# Altium schematic sheet 2_MCU.SchDoc
size 420 x 297 mm; SheetNumber: 2; SheetTotal: 7
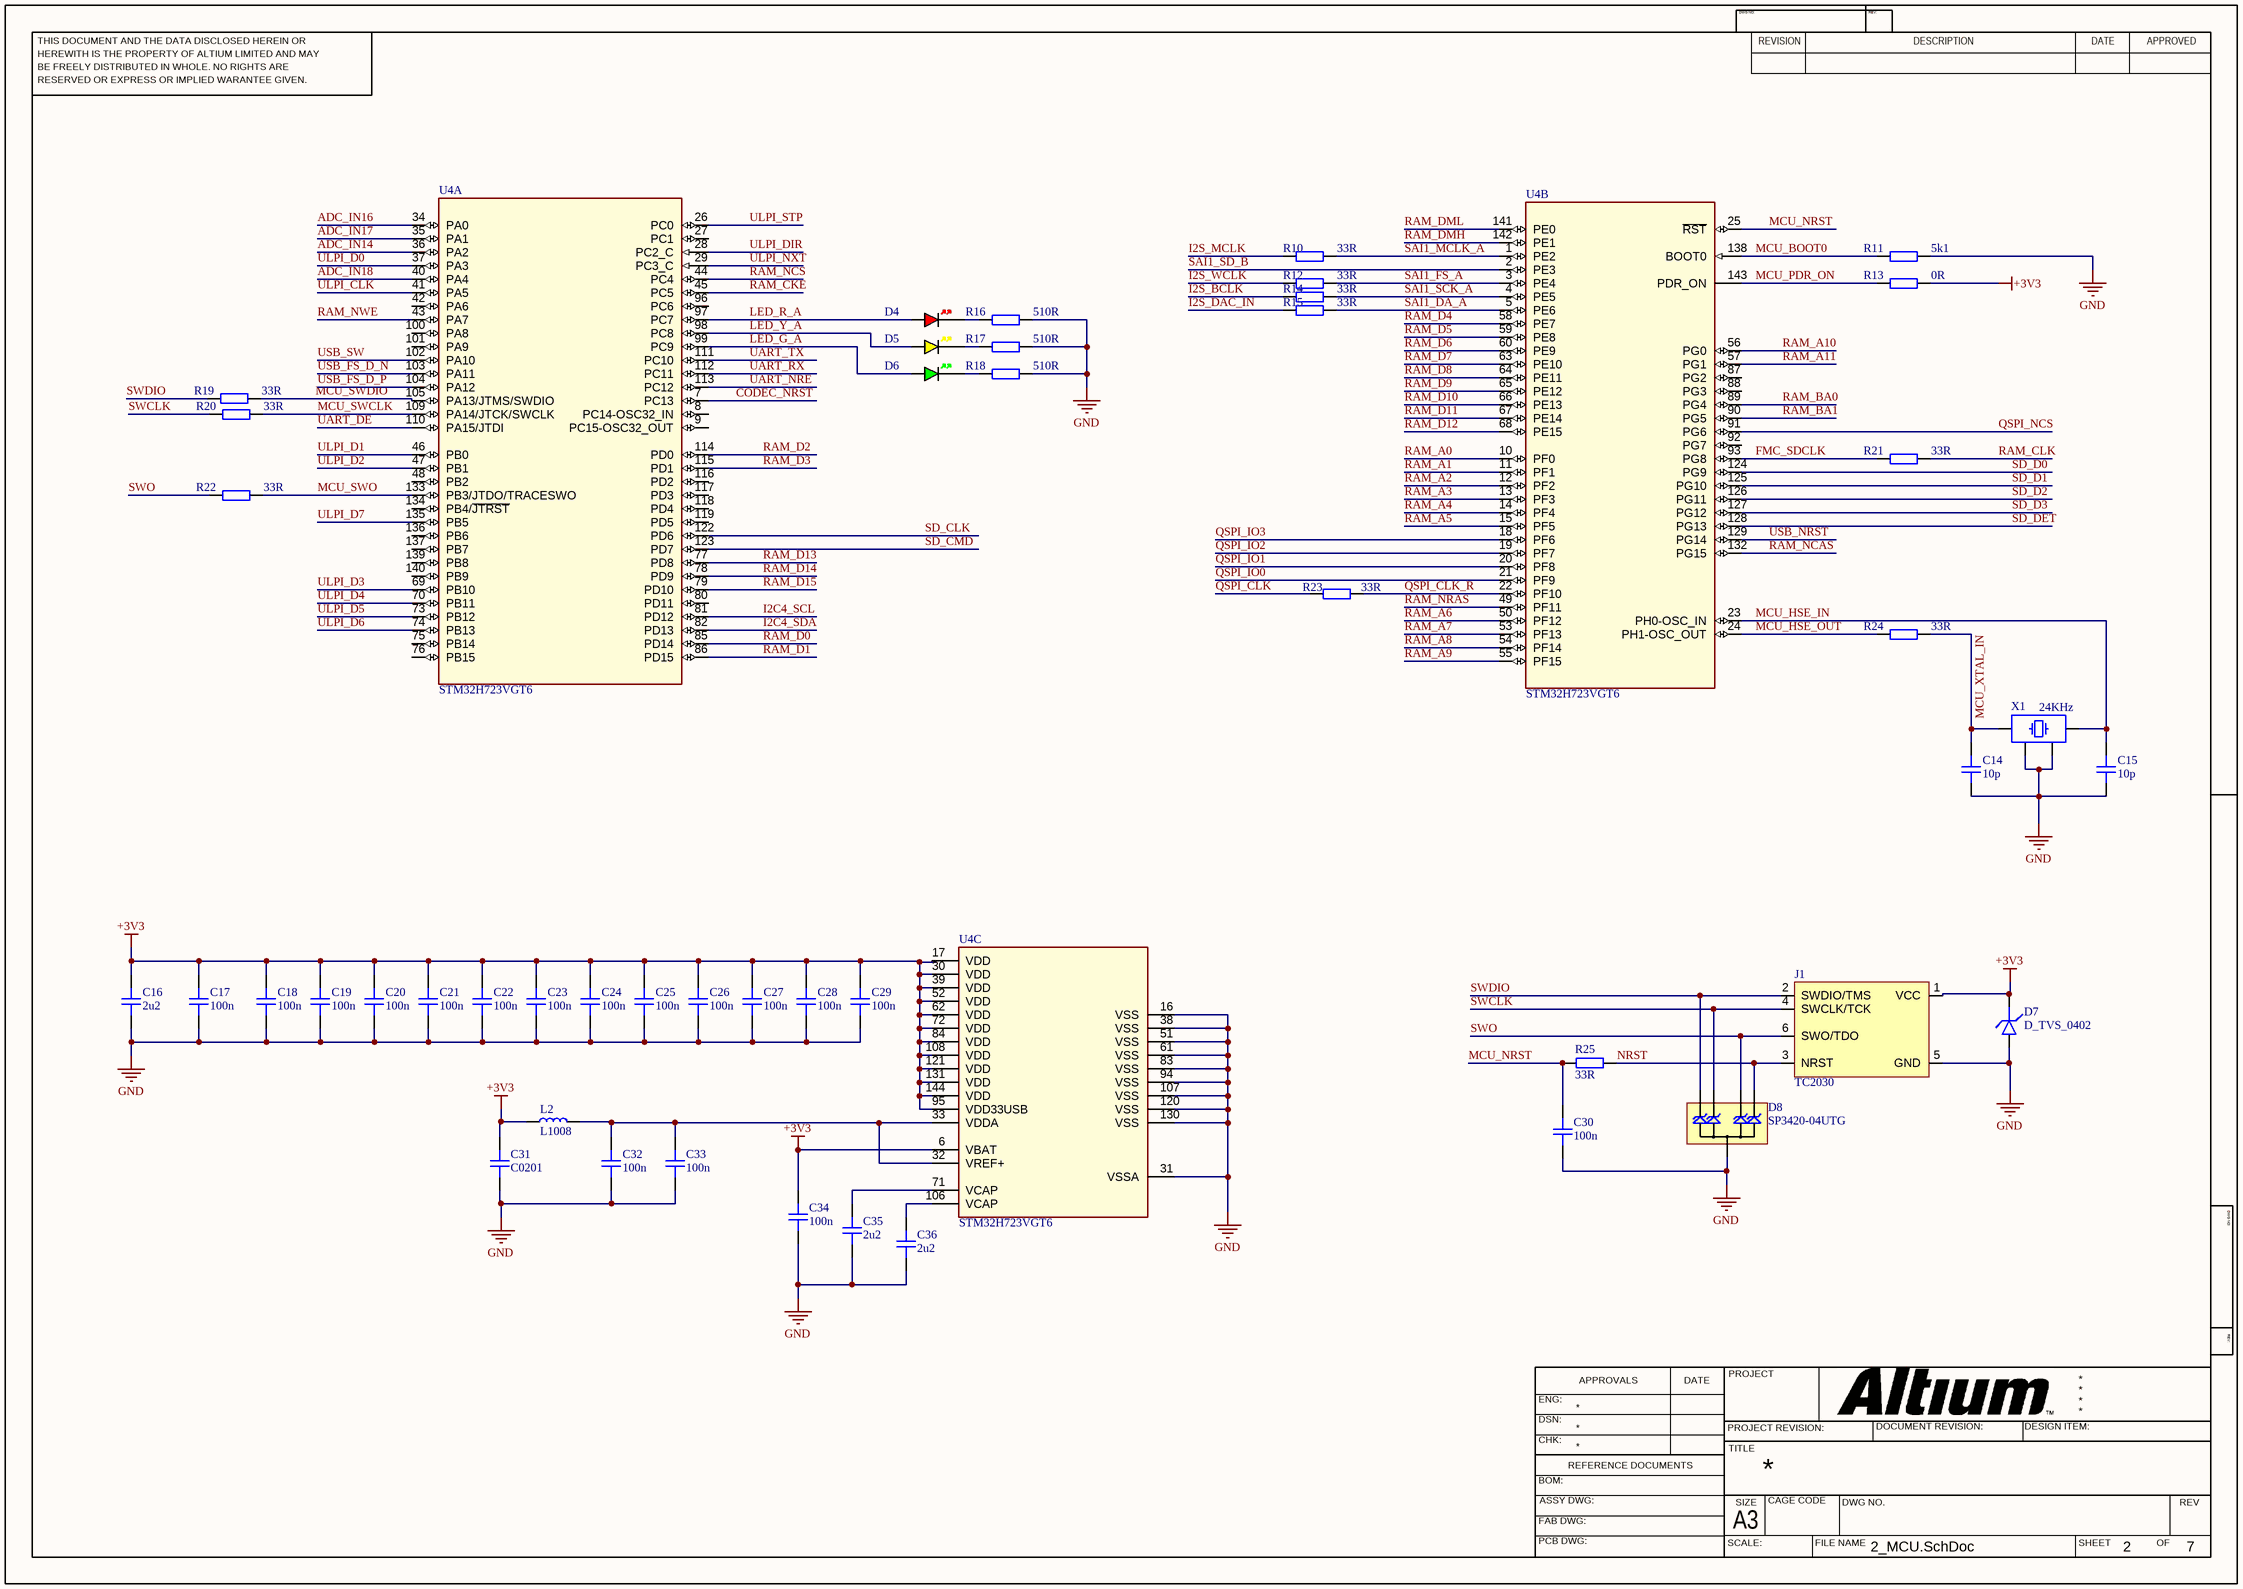
[diagram p0: 2_MCU.SchDoc]

## Parts
C14  10p  [CAP_0201]
C15  10p  [CAP_0201]
C16  2u2  [CAP_0201]
C17  100n  [CAP_0201]
C18  100n  [CAP_0201]
C19  100n  [CAP_0201]
C20  100n  [CAP_0201]
C21  100n  [CAP_0201]
C22  100n  [CAP_0201]
C23  100n  [CAP_0201]
C24  100n  [CAP_0201]
C25  100n  [CAP_0201]
C26  100n  [CAP_0201]
C27  100n  [CAP_0201]
C28  100n  [CAP_0201]
C29  100n  [CAP_0201]
C30  100n  [CAP_0201]
C31  C0201  [CAP_0201]
C32  100n  [CAP_0201]
C33  100n  [CAP_0201]
C34  100n  [CAP_0201]
C35  2u2  [CAP_0201]
C36  2u2  [CAP_0201]
D4  RED  [LED_0603_RED]  (value not drawn)
D5  YELLOW  [LED_0603_YELLOW]  (value not drawn)
D6  GREEN  [LED_0603_GREEN]  (value not drawn)
D7  D_TVS_0402  [D_0402]
D8  SP3420-04UTG  [uDFN-10]
J1  TC2030  [TC2030-FP]  (no BOM)
L2  L1008  [IND_1008]
R10  33R  [RES_0402]
R11  5k1  [RES_0402]
R12  33R  [RES_0402]
R13  0R  [RES_0402]
R14  33R  [RES_0402]
R15  33R  [RES_0402]
R16  510R  [RES_0402]
R17  510R  [RES_0402]
R18  510R  [RES_0402]
R19  33R  [RES_0402]
R20  33R  [RES_0402]
R21  33R  [RES_0402]
R22  33R  [RES_0402]
R23  33R  [RES_0402]
R24  33R  [RES_0402]
R25  33R  [RES_0402]
U4  STM32H723VGT6  [STM32H7]  (parts A,B,C of 3)
X1  24KHz  [XTAL_2520]

## Nets
+3V3: C16.2 C17.2 C18.2 C19.2 C20.2 C21.2 C22.2 C23.2 C24.2 C25.2 C26.2 C27.2 C28.2 C29.2 C31.2 C34.2 D7.K J1.1(VCC) L2.1 R13.2 U4.6(VBAT) U4.30(VDD) U4.39(VDD) U4.52(VDD) U4.62(VDD) U4.72(VDD) U4.84(VDD) U4.95(VDD33USB) U4.108(VDD) U4.121(VDD) U4.131(VDD) U4.144(VDD)
GND: C14.1 C15.1 C16.1 C17.1 C18.1 C19.1 C20.1 C21.1 C22.1 C23.1 C24.1 C25.1 C26.1 C27.1 C28.1 C29.1 C30.1 C31.1 C32.1 C33.1 C34.1 C35.1 C36.1 D7.A D8.38(GND) J1.5(GND) R11.2 R16.2 R17.2 R18.2 U4.16(VSS) U4.31(VSSA) U4.38(VSS) U4.51(VSS) U4.61(VSS) U4.83(VSS) U4.94(VSS) U4.107(VSS) U4.120(VSS) U4.130(VSS) X1.2 X1.4
ADC_IN14: U4.36(PA2)
ADC_IN16: U4.34(PA0)
ADC_IN17: U4.35(PA1)
ADC_IN18: U4.40(PA4)
CODEC_NRST: U4.7(PC13)
FMC_SDCLK: R21.1 U4.93(PG8)
I2C4_SCL: U4.81(PD12)
I2C4_SDA: U4.82(PD13)
I2S_BCLK: R14.1
I2S_DAC_IN: R15.1
I2S_MCLK: R10.1
I2S_WCLK: R12.1
LED_G_A: D6.A U4.99(PC9)
LED_R_A: D4.A U4.97(PC7)
LED_Y_A: D5.A U4.98(PC8)
MCU_BOOT0: R11.1 U4.138(BOOT0)
MCU_HSE_IN: C15.2 U4.23(PH0-OSC_IN) X1.3
MCU_HSE_OUT: R24.1 U4.24(PH1-OSC_OUT)
MCU_NRST: C30.2 R25.1 U4.25(~{RST})
MCU_PDR_ON: R13.1 U4.143(PDR_ON)
MCU_SWCLK: R20.2 U4.109(PA14/JTCK/SWCLK)
MCU_SWDIO: R19.2 U4.105(PA13/JTMS/SWDIO)
MCU_SWO: R22.2 U4.133(PB3/JTDO/TRACESWO)
MCU_XTAL_IN: C14.2 R24.2 X1.1
NRST: D8.56 J1.3(NRST) R25.2
QSPI_CLK: R23.1
QSPI_CLK_R: R23.2 U4.22(PF10)
QSPI_IO0: U4.21(PF9)
QSPI_IO1: U4.20(PF8)
QSPI_IO2: U4.19(PF7)
QSPI_IO3: U4.18(PF6)
QSPI_NCS: U4.91(PG6)
RAM_A0: U4.10(PF0)
RAM_A1: U4.11(PF1)
RAM_A2: U4.12(PF2)
RAM_A3: U4.13(PF3)
RAM_A4: U4.14(PF4)
RAM_A5: U4.15(PF5)
RAM_A6: U4.50(PF12)
RAM_A7: U4.53(PF13)
RAM_A8: U4.54(PF14)
RAM_A9: U4.55(PF15)
RAM_A10: U4.56(PG0)
RAM_A11: U4.57(PG1)
RAM_BA0: U4.89(PG4)
RAM_BA1: U4.90(PG5)
RAM_CKE: U4.45(PC5)
RAM_CLK: R21.2
RAM_D0: U4.85(PD14)
RAM_D1: U4.86(PD15)
RAM_D2: U4.114(PD0)
RAM_D3: U4.115(PD1)
RAM_D4: U4.58(PE7)
RAM_D5: U4.59(PE8)
RAM_D6: U4.60(PE9)
RAM_D7: U4.63(PE10)
RAM_D8: U4.64(PE11)
RAM_D9: U4.65(PE12)
RAM_D10: U4.66(PE13)
RAM_D11: U4.67(PE14)
RAM_D12: U4.68(PE15)
RAM_D13: U4.77(PD8)
RAM_D14: U4.78(PD9)
RAM_D15: U4.79(PD10)
RAM_DMH: U4.142(PE1)
RAM_DML: U4.141(PE0)
RAM_NCAS: U4.132(PG15)
RAM_NCS: U4.44(PC4)
RAM_NRAS: U4.49(PF11)
RAM_NWE: U4.43(PA7)
SAI1_DA_A: R15.2 U4.5(PE6)
SAI1_FS_A: R12.2 U4.3(PE4)
SAI1_MCLK_A: R10.2 U4.1(PE2)
SAI1_SCK_A: R14.2 U4.4(PE5)
SAI1_SD_B: U4.2(PE3)
SD_CLK: U4.122(PD6)
SD_CMD: U4.123(PD7)
SD_D0: U4.124(PG9)
SD_D1: U4.125(PG10)
SD_D2: U4.126(PG11)
SD_D3: U4.127(PG12)
SD_DET: U4.128(PG13)
SWCLK: D8.29 J1.4(SWCLK/TCK) R20.1
SWDIO: D8.110 J1.2(SWDIO/TMS) R19.1
SWO: D8.47 J1.6(SWO/TDO) R22.1
UART_DE: U4.110(PA15/JTDI)
UART_NRE: U4.113(PC12)
UART_RX: U4.112(PC11)
UART_TX: U4.111(PC10)
ULPI_CLK: U4.41(PA5)
ULPI_D0: U4.37(PA3)
ULPI_D1: U4.46(PB0)
ULPI_D2: U4.47(PB1)
ULPI_D3: U4.69(PB10)
ULPI_D4: U4.70(PB11)
ULPI_D5: U4.73(PB12)
ULPI_D6: U4.74(PB13)
ULPI_D7: U4.135(PB5)
ULPI_DIR: U4.28(PC2_C)
ULPI_NXT: U4.29(PC3_C)
ULPI_STP: U4.26(PC0)
USB_FS_D_N: U4.103(PA11)
USB_FS_D_P: U4.104(PA12)
USB_NRST: U4.129(PG14)
USB_SW: U4.102(PA10)
NetC32_2: C32.2 C33.2 L2.2 U4.32(VREF+) U4.33(VDDA)
NetC35_2: C35.2 U4.71(VCAP)
NetC36_2: C36.2 U4.106(VCAP)
NetD4_K: D4.K R16.1
NetD5_K: D5.K R17.1
NetD6_K: D6.K R18.1

Not connected (* = marked no-connect by the designer): U4 8(PC14-OSC32_IN) 9(PC15-OSC32_OUT) 17(VDD) 27(PC1) 42(PA6) 48(PB2) 75(PB14) 76(PB15) 80(PD11) 87(PG2) 88(PG3) 92(PG7) 96(PC6) 100(PA8) 101(PA9) 116(PD2) 117(PD3) 118(PD4) 119(PD5) 134(PB4/~{JTRST}) 136(PB6) 137(PB7) 139(PB8) 140(PB9)

## Notes on the sheet
- THIS DOCUMENT AND THE DATA DISCLOSED HEREIN OR
- HEREWITH IS THE PROPERTY OF ALTIUM LIMITED AND MAY
- DWG NO:
- REVISION
- REV:
- DESCRIPTION
- DATE
- APPROVED
- BE FREELY DISTRIBUTED IN WHOLE. NO RIGHTS ARE
- RESERVED OR EXPRESS OR IMPLIED WARANTEE GIVEN.
- ENG:
- APPROVALS
- PROJECT
- DSN:
- CHK:
- REFERENCE DOCUMENTS
- PROJECT REVISION:
- TITLE
- DOCUMENT REVISION:
- DESIGN ITEM:
- BOM:
- FAB DWG:
- PCB DWG:
- ASSY DWG:
- SCALE:
- A3
- SIZE
- CAGE CODE
- FILE NAME
- DWG NO.
- SHEET
- OF
- REV

## Library data of the parts
C14-C36 = CAP_0201: Capacitor SMD 0201; Manufacturer: *; Manufacturer Part Number: *; Distributor Link: *; LCSC: *; Rating: *; Dielectric: *
D4 = LED_0603_RED: LED 0603 RED SMD
D5 = LED_0603_YELLOW: LED 0603 YELLOW SMD
D6 = LED_0603_GREEN: LED 0603 GREEN SMD
D7 = D_TVS_0402: Diode TVS / ESD 0402
D8 = SP3420-04UTG: TVS Diode Array Low Capacitance ESD Protection 4-Channel (Vwork=3V3, Vclamp=6V); Manufacturer: Littelfuse; Manufacturer Part Number: SP3420-04UTG
J1 = TC2030: Tag-Connect No-Solder SWD Debug Connector DO NOT PLACE; Manufacturer: Tag-Connect; Manufacturer Part Number: TC2030
L2 = IND_1008: Inductor SMD 1008
R10-R25 = RES_0402: Resistor SMD 0402; Manufacturer: *; Manufacturer Part Number: *; Distributor Link: *; LCSC: *
X1 = XTAL_2520: Crystal SMD 2520; Distributor Link: *